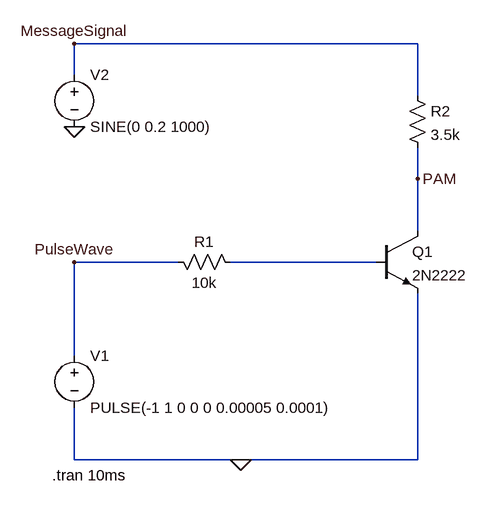
[diagram p0: schematic PAM.asc]
PAM.asc, the LTspice schematic file:
Version 4
SHEET 1 880 680
WIRE 448 -256 -80 -256
WIRE -80 -208 -80 -256
WIRE 448 -176 448 -256
WIRE 448 -48 448 -96
WIRE 448 32 448 -48
WIRE 80 80 -80 80
WIRE 384 80 160 80
WIRE -80 224 -80 80
WIRE -80 384 -80 304
WIRE 176 384 -80 384
WIRE 448 384 448 128
WIRE 448 384 176 384
FLAG -80 -128 0
FLAG 176 384 0
FLAG -80 -256 MessageSignal
FLAG -80 80 PulseWave
FLAG 448 -48 PAM
DATAFLAG -80 -256 ""
SYMBOL res 64 64 M90
WINDOW 0 0 56 VBottom 2
WINDOW 3 32 56 VTop 2
SYMATTR InstName R1
SYMATTR Value 10k
SYMBOL npn 384 32 R0
SYMATTR InstName Q1
SYMATTR Value 2N2222
SYMBOL voltage -80 208 R0
WINDOW 123 0 0 Left 0
WINDOW 39 0 0 Left 0
SYMATTR InstName V1
SYMATTR Value PULSE(-1 1 0 0 0 0.00005 0.0001)
SYMBOL res 432 -192 R0
SYMATTR InstName R2
SYMATTR Value 3.5k
SYMBOL voltage -80 -224 R0
WINDOW 123 0 0 Left 0
WINDOW 39 0 0 Left 0
SYMATTR InstName V2
SYMATTR Value SINE(0 0.2 1000)
TEXT -114 408 Left 2 !.tran 10ms

The netlist it stands for:
* PAM.asc
R1 PulseWave N001 10k
Q1 PAM N001 0 0 2N2222
V1 PulseWave 0 PULSE(-1 1 0 0 0 0.00005 0.0001)
R2 MessageSignal PAM 3.5k
V2 MessageSignal 0 SINE(0 0.2 1000)
.model NPN NPN
.model PNP PNP
.lib standard.bjt
.tran 10ms
.backanno
.end